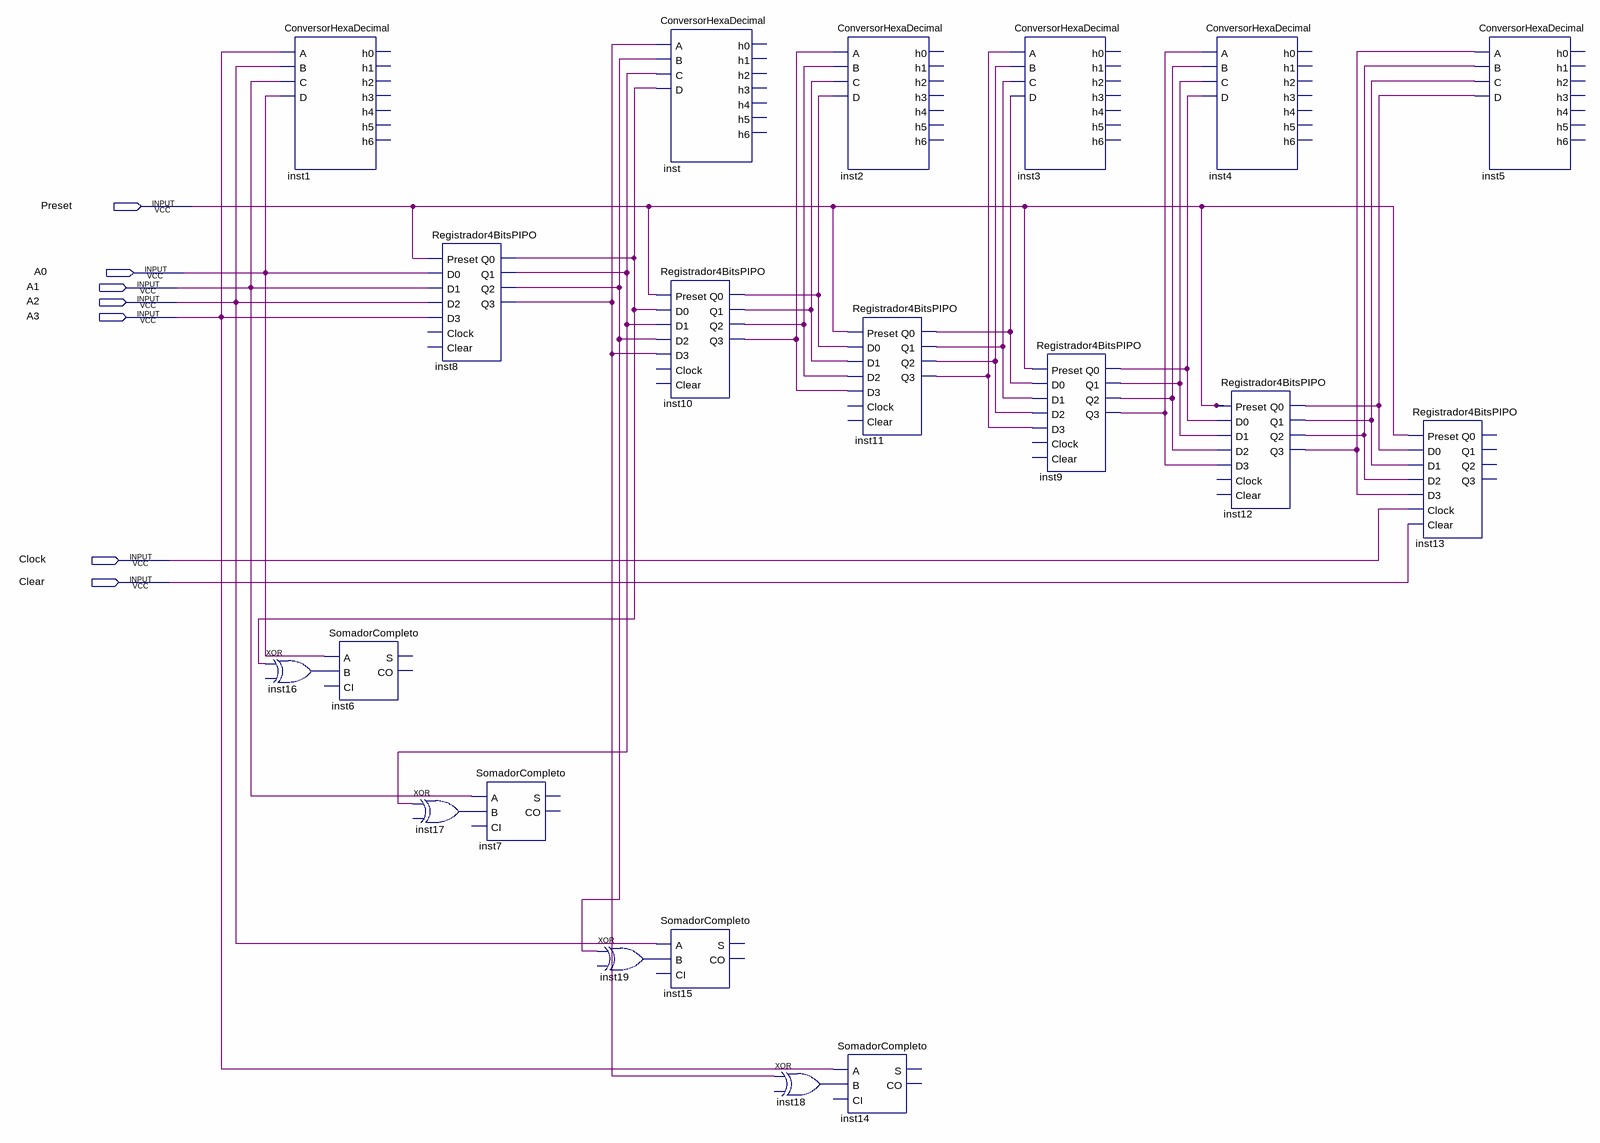
[diagram p0: schematic sheet]
// Quartus schematic Registradores.bdf as structural Verilog: 20 symbols, 7 pins
module Registradores (
  input  Preset,
  input  A0,
  input  A1,
  input  A2,
  input  A3,
  input  Clock,
  input  Clear
);

  wire inst8_q0, inst8_q1, inst8_q2, inst8_q3, inst9_q0, inst9_q1, inst9_q2, inst9_q3, inst10_q0, inst10_q1,
       inst10_q2, inst10_q3, inst11_q0, inst11_q1, inst11_q2, inst11_q3, inst12_q0, inst12_q1, inst12_q2,
       inst12_q3, inst16_out, inst17_out, inst18_out, inst19_out;

  ConversorHexaDecimal inst1 (.A(A3), .B(A2), .C(A1), .D(A0));  // open: h0, h1, h2, h3, h4, h5, h6
  buf inst16 (inst16_out, inst8_q0);  // XOR open: IN2
  SomadorCompleto inst6 (.A(A0), .B(inst16_out));  // open: CI, S, CO
  buf inst17 (inst17_out, inst8_q1);  // XOR open: IN2
  Registrador4BitsPIPO inst8 (
    .Preset(Preset), .D0(A0), .D1(A1), .D2(A2), .D3(A3), .Q0(inst8_q0), .Q1(inst8_q1), .Q2(inst8_q2),
    .Q3(inst8_q3));  // open: Clock, Clear
  SomadorCompleto inst7 (.A(A1), .B(inst17_out));  // open: CI, S, CO
  buf inst19 (inst19_out, inst8_q2);  // XOR open: IN2
  ConversorHexaDecimal inst (
    .A(inst8_q3), .B(inst8_q2), .C(inst8_q1), .D(inst8_q0));  // open: h0, h1, h2, h3, h4, h5, h6
  Registrador4BitsPIPO inst10 (
    .Preset(Preset), .D0(inst8_q0), .D1(inst8_q1), .D2(inst8_q2), .D3(inst8_q3), .Q0(inst10_q0),
    .Q1(inst10_q1), .Q2(inst10_q2), .Q3(inst10_q3));  // open: Clock, Clear
  SomadorCompleto inst15 (.A(A2), .B(inst19_out));  // open: CI, S, CO
  buf inst18 (inst18_out, inst8_q3);  // XOR open: IN2
  ConversorHexaDecimal inst2 (
    .A(inst10_q3), .B(inst10_q2), .C(inst10_q1), .D(inst10_q0));  // open: h0, h1, h2, h3, h4, h5, h6
  Registrador4BitsPIPO inst11 (
    .Preset(Preset), .D0(inst10_q0), .D1(inst10_q1), .D2(inst10_q2), .D3(inst10_q3), .Q0(inst11_q0),
    .Q1(inst11_q1), .Q2(inst11_q2), .Q3(inst11_q3));  // open: Clock, Clear
  SomadorCompleto inst14 (.A(A3), .B(inst18_out));  // open: CI, S, CO
  ConversorHexaDecimal inst3 (
    .A(inst11_q3), .B(inst11_q2), .C(inst11_q1), .D(inst11_q0));  // open: h0, h1, h2, h3, h4, h5, h6
  Registrador4BitsPIPO inst9 (
    .Preset(Preset), .D0(inst11_q0), .D1(inst11_q1), .D2(inst11_q2), .D3(inst11_q3), .Q0(inst9_q0),
    .Q1(inst9_q1), .Q2(inst9_q2), .Q3(inst9_q3));  // open: Clock, Clear
  ConversorHexaDecimal inst4 (
    .A(inst9_q3), .B(inst9_q2), .C(inst9_q1), .D(inst9_q0));  // open: h0, h1, h2, h3, h4, h5, h6
  Registrador4BitsPIPO inst12 (
    .Preset(Preset), .D0(inst9_q0), .D1(inst9_q1), .D2(inst9_q2), .D3(inst9_q3), .Q0(inst12_q0),
    .Q1(inst12_q1), .Q2(inst12_q2), .Q3(inst12_q3));  // open: Clock, Clear
  Registrador4BitsPIPO inst13 (
    .Preset(Preset), .D0(inst12_q0), .D1(inst12_q1), .D2(inst12_q2), .D3(inst12_q3), .Clock(Clock),
    .Clear(Clear));  // open: Q0, Q1, Q2, Q3
  ConversorHexaDecimal inst5 (
    .A(inst12_q3), .B(inst12_q2), .C(inst12_q1), .D(inst12_q0));  // open: h0, h1, h2, h3, h4, h5, h6
endmodule
